# Altium schematic sheet VOUT_0.2-2V.SchDoc
size A4; SheetNumber: 2; SheetTotal: 8
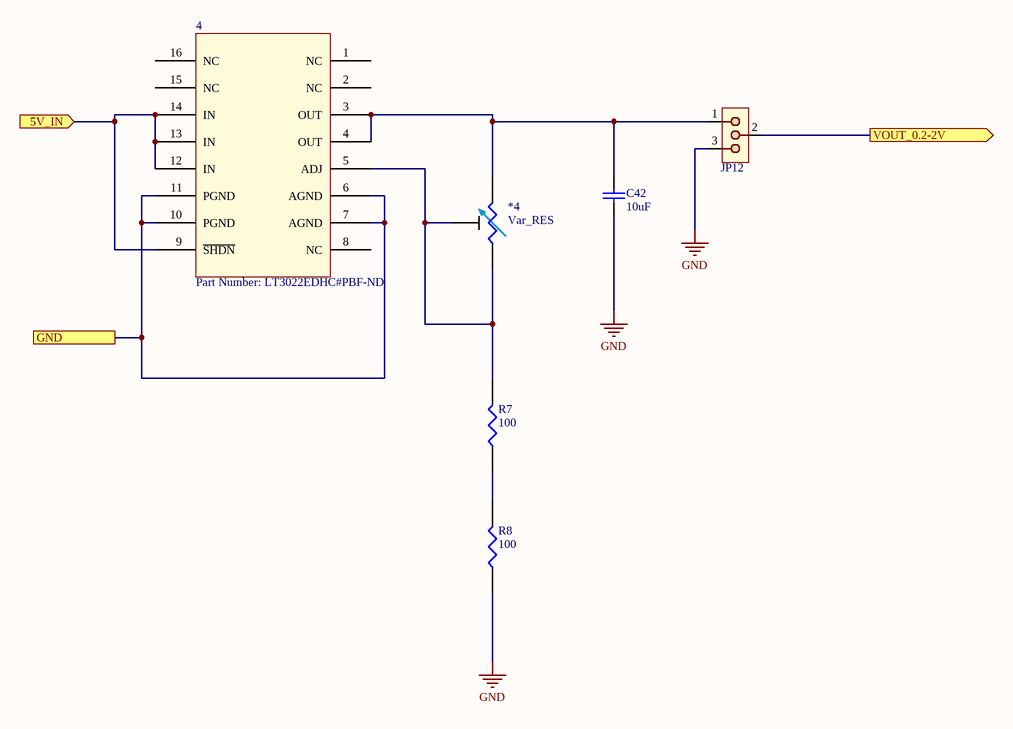
[diagram p0: VOUT_0.2-2V.SchDoc]

## Parts
4  Part Number: LT3022EDHC#PBF-ND  [LT3022]
*4  Var_RES  [res_var_5turn]
C42  10uF  [C0805]
JP12  Jumper  [01x03_0.1in_th_straight_b_nom]  (value not drawn)
R7  100  [R0805]
R8  100  [R0805]

## Ports
5V_IN (in), GND, VOUT_0.2-2V (out)

## Nets
GND: C42.1 JP12.3 R8.1
5V_IN: 4.9(~{SHDN}) 4.12(IN) 4.13(IN) 4.14(IN) ; port 5V_IN
GND: 4.6(AGND) 4.7(AGND) 4.10(PGND) 4.11(PGND) ; port GND  [a separate net that carries the same name]
VOUT_0.2-2V: JP12.2 ; port VOUT_0.2-2V
Net4_3: 4.3(OUT) 4.4(OUT) *4.3 C42.2 JP12.1
Net4_5: 4.5(ADJ) *4.1 *4.2 R7.2
NetR7_1: R7.1 R8.2

Not connected (* = marked no-connect by the designer): 4 1(NC) 2(NC) 8(NC) 15(NC) 16(NC)

## Library data of the parts
4 = LT3022: Linear Voltage Regulator IC Positive Adjustable 1 Output 1A 16-DFN (5x3)
C42 = Cap 10uF: Manufacturer: Taiyo Yuden; Manufacturer Part Number: UMK212SD103KD-T; Dielectric Material: Ceramic; Capacitance: 10nF; Tolerance: 10%; Voltage Rating: 50V; Supplier 1: Digi-Key; Stock 1: 14125; Pricing 1: 1=0.47, 10=0.323, 100=0.1941, 500=0.1455, 1000=0.1229 (USD); Mount: Surface Mount; Case/Package: 0805; Number of Pins: 2; Case Code (Metric): 2012; Case Code (Imperial): 0805; Min Operating Temperature: -55°C; Max Operating Temperature: 125°C; Packaging: Tape and Reel; Package Quantity: 1; Voltage Rating (DC): 50V; Termination: SMD/SMT; Length: 2mm; Height: 0.85mm; Width: 0.049inch; Thickness: 0.037inch; Depth: 1.25mm; Radiation Hardening: No; Lead Free: Lead Free; Halogen Free: Halogen Free; ComponentLink1URL: https://datasheet.ciiva.com/138/umk212sd103kd-t-ss-138661.pdf; ComponentLink1Description: https://datasheet.ciiva.com/138/umk212sd103kd-t-ss-138661.pdf; ComponentLink2URL: https://datasheet.ciiva.com/138/mlcc07-e-138662.pdf; ComponentLink2Description: https://datasheet.ciiva.com/138/mlcc07-e-138662.pdf; ComponentLink3URL: https://datasheet.ciiva.com/138/mlcc07-e-138663.pdf; ComponentLink3Description: https://datasheet.ciiva.com/138/mlcc07-e-138663.pdf; ComponentLink4URL: https://datasheet.ciiva.com/30140/303umk212sd103kd-t-30140925.pdf; ComponentLink4Description: https://datasheet.ciiva.com/30140/303umk212sd103kd-t-30140925.pdf; Supplier Part Number 1: 587-1114-1-ND
JP12 = Jumper-01x03: 01X03 generic terminal connector
R7 R8 = Res 100